# Altium schematic sheet Sheet1.SchDoc
size A3; SheetNumber: 1; SheetTotal: 1
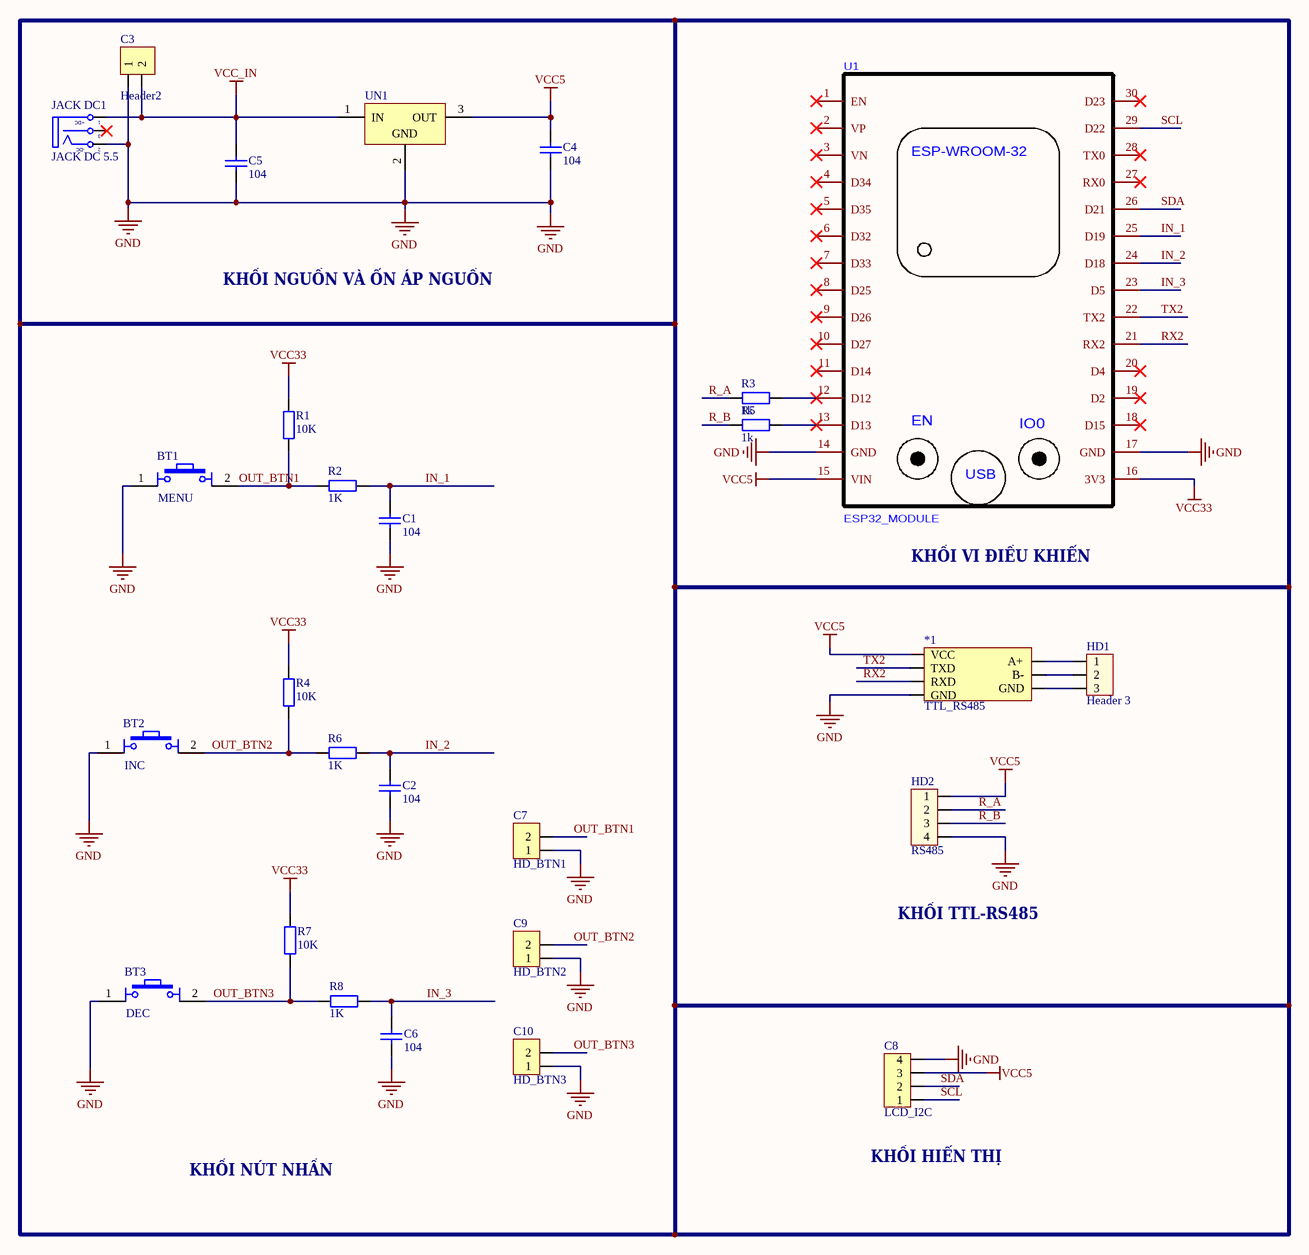
[diagram p0: Sheet1.SchDoc]

## Parts
*1  TTL_RS485  [RS-485 Module]
BT1  MENU  [Nut Nhan 4 Chan Cam 6x6]
BT2  INC  [Nut Nhan 4 Chan Cam 6x6]
BT3  DEC  [Nut Nhan 4 Chan Cam 6x6]
C1  104  [tu gom]
C2  104  [tu gom]
C3  Header2  [Header2]
C4  104  [tu gom]
C5  104  [tu gom]
C6  104  [tu gom]
C7  HD_BTN1  [Header2]
C8  LCD_I2C  [Header4]
C9  HD_BTN2  [Header2]
C10  HD_BTN3  [Header2]
HD1  Header 3  [HED3]
HD2  RS485  [HED4]
JACK_DC1  JACK DC 5.5  [JACK DC 5.5]
R1  10K  [R1/4W]
R2  1K  [R1/4W]
R3  1k  [R1/4W]
R4  10K  [R1/4W]
R5  1k  [R1/4W]
R6  1K  [R1/4W]
R7  10K  [R1/4W]
R8  1K  [R1/4W]
U1  ESP32_MODULE  [ESP32-WIFIMODULE-FOOTPRINT]
UN1  L78M05CP  [QTO-220H2]  (value not drawn)

## Nets
GND: *1.4(GND) BT1.1 BT2.1 BT3.1 C1.2 C2.2 C3.1 C4.2 C5.2 C6.2 C7.1 C8.4 C9.1 C10.1 HD2.4 JACK_DC1.2(TN) U1.14(GND) U1.17(GND) UN1.2(GND)
VCC5: *1.1(VCC) C4.1 C8.3 HD2.1 U1.15(VIN) UN1.3(OUT)
VCC33: R1.2 R4.2 R7.2 U1.16(3V3)
VCC_IN: C3.2 C5.1 JACK_DC1.1(T) UN1.1(IN)
IN_1: C1.1 R2.1 U1.25(D19)
IN_2: C2.1 R6.1 U1.24(D18)
IN_3: C6.1 R8.1 U1.23(D5)
OUT_BTN1: BT1.2 C7.2 R1.1 R2.2
OUT_BTN2: BT2.2 C9.2 R4.1 R6.2
OUT_BTN3: BT3.2 C10.2 R7.1 R8.2
R_A: HD2.2 R3.1
R_B: HD2.3 R5.1
RX2: *1.3(RXD) U1.21(RX2)
SCL: C8.1 U1.29(D22)
SDA: C8.2 U1.26(D21)
TX2: *1.2(TXD) U1.22(TX2)
Net*1_5: *1.5(GND) HD1.3
Net*1_6: *1.6(B-) HD1.2
Net*1_7: *1.7(A+) HD1.1
NetR3_2: R3.2 U1.12(D12)
NetR5_2: R5.2 U1.13(D13)

Not connected (* = marked no-connect by the designer): JACK_DC1 3(S)*; U1 1(EN)* 2(VP)* 3(VN)* 4(D34)* 5(D35)* 6(D32)* 7(D33)* 8(D25)* 9(D26)* 10(D27)* 11(D14)* 18(D15)* 19(D2)* 20(D4)* 27(RX0)* 28(TX0)* 30(D23)*

## Notes on the sheet
- KHỐI NGUỒN VÀ ỔN ÁP NGUỒN
- KHỐI VI ĐIỀU KHIỂN
- KHỐI TTL-RS485
- KHỐI NÚT NHẤN
- (near C8) KHỐI HIỂN THỊ
- (in symbol ESP32_MODULE copy) ESP-WROOM-32; IO0; USB
- (in symbol JACK DC 5.5) +DC; -DC

## Library data of the parts
BT1-BT3 = Nut Nhan 4 Chan Cam 6x6: Nut Nhan 4 Chan 6x6mm; Ten: Nút Nhấn 4 Chân 6x6x5MM DIP; Ma_Hang: MH004584
C1 C2 C4-C6 = Tu gom 104 50V: Cắm; So_Chan: 2; Ten_Linh_Kien: Tụ gốm 104 100nF 50V; Don_Vi: Con; Ma_Hang: MH004761; Chung_Loai: Cắm; Kieu_Chan: *
C3 C7 C9 C10 = Header2: Header IDC, 2 x 1 Pin Vertical 2.54mm Pitch (Non-Boxed, Male); Manufacturer: W¨¹rth Elektronik eiSos GmbH; partNo: 613002143121; ComponentLink1 Description: Manufacturer; ComponentLink2 Description: Datasheet; NoPins: 02; Created Date: 29 March 2013; ComponentLink1URL: http://www.we-online.com; ComponentLink2URL: http://katalog.we-online.de/em/datasheet/6130xx143121.pdf; Created by: Karrer Zheng
C8 = Header4: Header IDC, 4 x 1 Pin Vertical 2.54mm Pitch (Non-Boxed, Male); Manufacturer: W¨¹rth Elektronik eiSos GmbH; partNo: 613002143121; ComponentLink1 Description: Manufacturer; ComponentLink2 Description: Datasheet; NoPins: 02; Created Date: 29 March 2013; ComponentLink1URL: http://www.we-online.com; ComponentLink2URL: http://katalog.we-online.de/em/datasheet/6130xx143121.pdf; Created by: Karrer Zheng
HD1 = Hed3: Header 3 (Green); Value: Header 3
HD2 = Hed4: Header 4 (Green); Value: Header 4
JACK_DC1 = JACK DC 5.5: Value: Jac DC
R1-R8 = R1/4W: Resistor 1/4W; Value: R1/4W - 1K
U1 = ESP32_MODULE copy
UN1 = L78M05CP: Positive Voltage Regulator; Note: Tab is connected to pin 3 (GND).; Published: 24-Aug-2001; LatestRevisionDate: 17-Jul-2002; LatestRevisionNote: Re-released for DXP Platform.; DatasheetVersion: Apr-1994; PackageVersion: Jul-1998; PackageReference: ISOWATT220AB; Publisher: Altium Limited; PackageDescription: TO, Thru-Hole, Vertical, Heatsink Mounted; 3 In-Line Leads; Pitch 2.54 mm; Pin sequence 1, 3, 2; ComponentLink1Description: Manufacturer Link; ComponentLink1URL: http://www.st.com/; ComponentLink2Description: Datasheet; ComponentLink2URL: http://www.st.com/stonline/products/literature/ds/2146/l78m05c.pdf